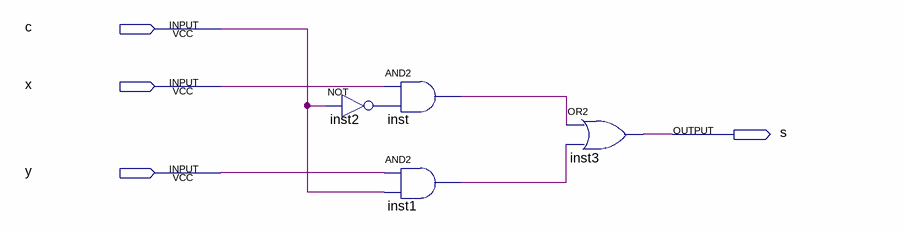
[diagram p0: schematic sheet]
// Quartus schematic MUX.bdf as structural Verilog: 4 symbols, 4 pins
module MUX (
  input  c,
  input  x,
  input  y,
  output s
);

  wire inst1_out, inst2_out, inst_out;

  not inst2 (inst2_out, c);
  and inst (inst_out, x, inst2_out);
  and inst1 (inst1_out, y, c);
  or inst3 (s, inst_out, inst1_out);
endmodule
